# Altium schematic sheet ST_LINK_V2.SchDoc
size A4; SheetNumber: 2; SheetTotal: 5
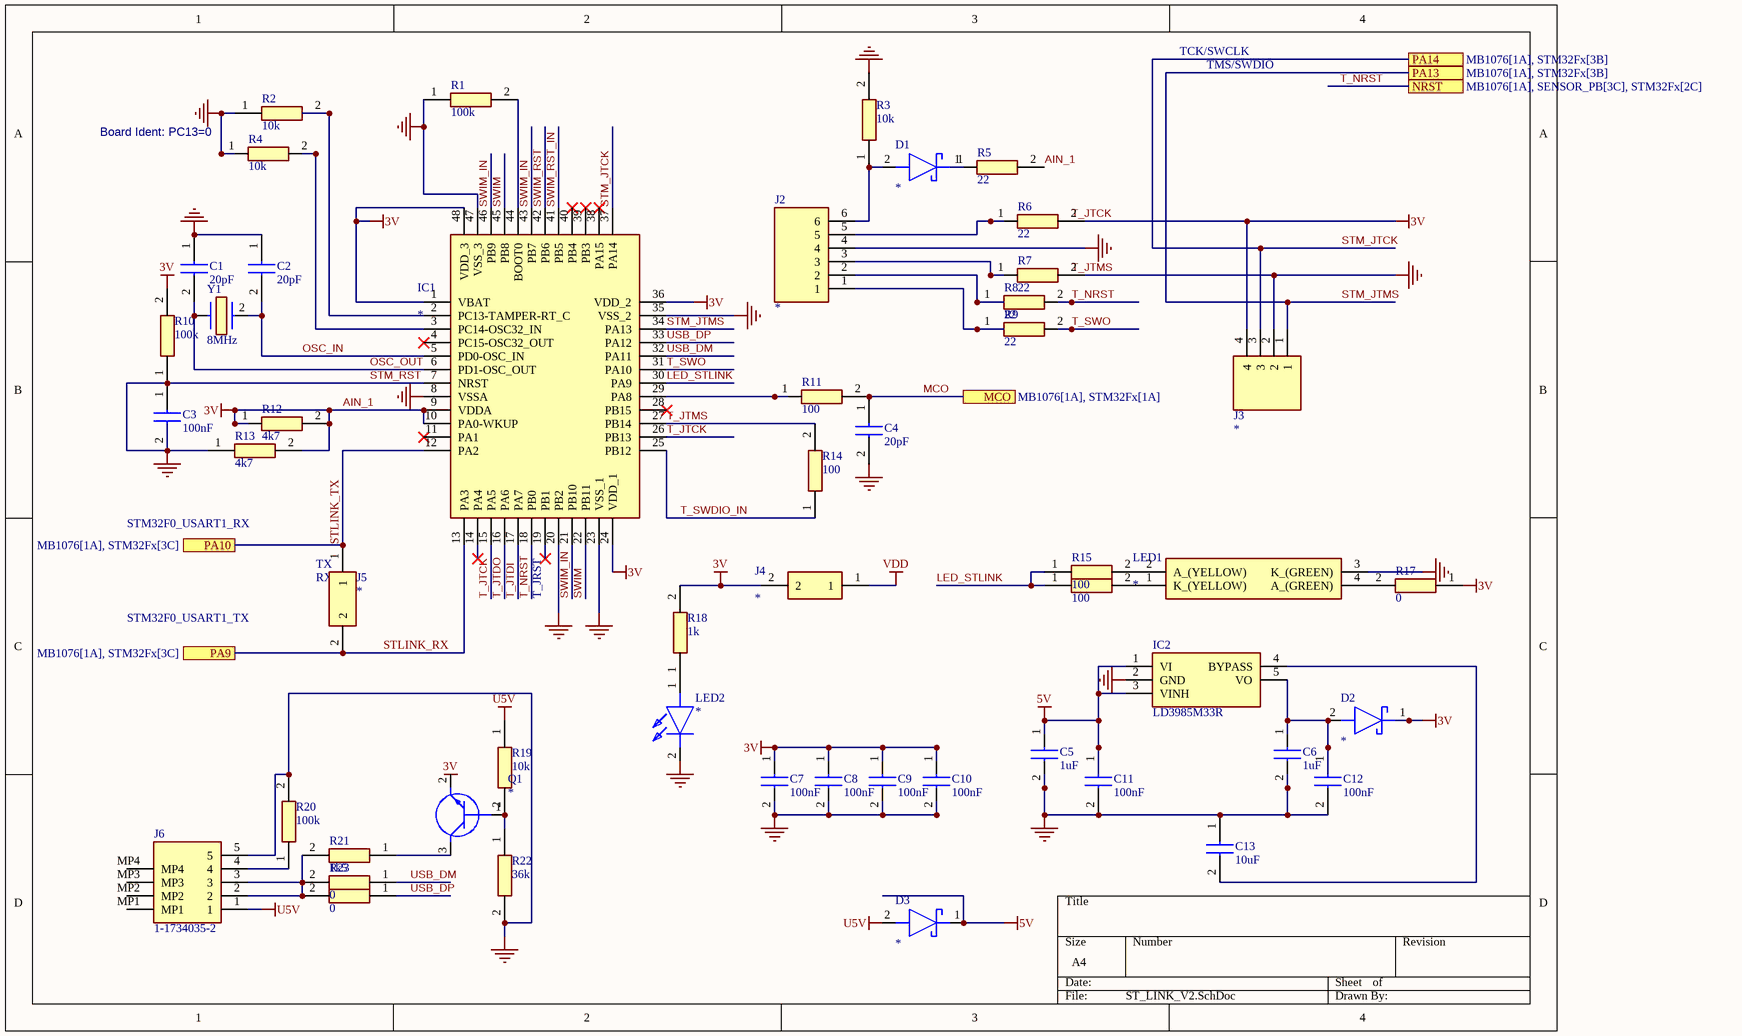
[diagram p0: ST_LINK_V2.SchDoc]

## Parts
C1  20pF  [ECHU_J1_J2_17_21]
C2  20pF  [ECHU_J1_J2_17_21]
C3  100nF  [ECHU_J1_J2_17_21]
C4  20pF  [ECHU_J1_J2_17_21]
C5  1uF  [ECHU_J1_J2_17_21]
C6  1uF  [ECHU_J1_J2_17_21]
C7  100nF  [ECHU_J1_J2_17_21]
C8  100nF  [ECHU_J1_J2_17_21]
C9  100nF  [ECHU_J1_J2_17_21]
C10  100nF  [ECHU_J1_J2_17_21]
C11  100nF  [ECHU_J1_J2_17_21]
C12  100nF  [ECHU_J1_J2_17_21]
C13  10uF  [ECHU_J1_J2_17_21]
D1  *  [SOD2513X117N]
D2  *  [SOD2513X117N]
D3  *  [SOD2513X117N]
IC1  *  [QFP50P900X900X160-48N]
IC2  LD3985M33R  [SOT95P280X145-5N]
J2  *  [HDRV6W64P0X254_1X6_1524X248X838P]
J3  *  [SHDR4W66P0X254_1X4_1016X635X1079P]
J4  *  [36471662]
J5  *  [36471662]
J6  1-1734035-2  [117340352]
LED1  *  [AVAGO_PLCC4]
LED2  *  [19213R6CAP1Q2B3T]
Q1  *  [SOT95P250X135-3N]
R1  100k  [RESC2012X60N]
R2  10k  [RESC2012X60N]
R3  10k  [RESC2012X60N]
R4  10k  [RESC2012X60N]
R5  22  [RESC2012X60N]
R6  22  [RESC2012X60N]
R7  22  [RESC2012X60N]
R8  22  [RESC2012X60N]
R9  22  [RESC2012X60N]
R10  100k  [RESC2012X60N]
R11  100  [RESC2012X60N]
R12  4k7  [RESC2012X60N]
R13  4k7  [RESC2012X60N]
R14  100  [RESC2012X60N]
R15  100  [RESC2012X60N]
R16  100  [RESC2012X60N]
R17  0  [RESC2012X60N]
R18  1k  [RESC2012X60N]
R19  10k  [RESC2012X60N]
R20  100k  [RESC2012X60N]
R21  1k5  [RESC2012X60N]
R22  36k  [RESC2012X60N]
R23  0  [RESC2012X60N]
R24  0  [RESC2012X60N]
Y1  8MHz  [FOXSDLF08020]

## Ports
MCO (see MB1076[1A], STM32Fx[1A]), NRST (see MB1076[1A], SENSOR_PB[3C], STM32Fx[2C]), PA9 (see MB1076[1A], STM32Fx[3C]), PA10 (see MB1076[1A], STM32Fx[3C]), PA13 (see MB1076[1A], STM32Fx[3B]), PA14 (see MB1076[1A], STM32Fx[3B])

## Nets
5V: C5.1 C11.1 D3.1(K) IC2.1(VI) IC2.3(VINH)
AIN_1: C7.1 C8.1 C9.1 C10.1 D2.1(K) IC1.1(VBAT) IC1.9(VDDA) IC1.10(PA0-WKUP) IC1.24(VDD_1) IC1.36(VDD_2) IC1.48(VDD_3) J3.4 J4.2 R5.2 R6.2 R10.2 R12.1 R12.2 R13.2 R17.1 R18.2  [also labelled 3V]
STM_RST: C1.1 C2.1 C3.1 C3.2 C4.2 C5.2 C6.2 C7.2 C8.2 C9.2 C10.2 C11.2 C12.2 C13.1 IC1.7(NRST) IC1.8(VSSA) IC1.20(PB2) IC1.23(VSS_1) IC1.35(VSS_2) IC1.47(VSS_3) IC2.2(GND) J2.4 J3.2 J6.5 LED1.3(K_(GREEN)) LED2.2(K) R1.1 R2.1 R3.2 R4.1 R7.2 R10.1 R13.1 R20.2 R22.2  [also labelled GND]
U5V: D3.2(A) J6.1 R19.1
VDD: J4.1
LED_STLINK: IC1.30(PA9) R15.1 R16.1
MCO: C4.1 R11.2 ; port MCO
OSC_IN: C2.2 IC1.5(PD0-OSC_IN) Y1.2(CRYSTAL_2)
OSC_OUT: C1.2 IC1.6(PD1-OSC_OUT) Y1.?1
STLINK_RX: IC1.13(PA3) J5.2 ; port PA9
STLINK_TX: IC1.12(PA2) J5.1 ; port PA10
STM_JTCK: IC1.37(PA14) J3.3 ; port PA14
STM_JTMS: IC1.34(PA13) J3.1 ; port PA13
SWIM: IC1.22(PB11) IC1.45(PB8)
SWIM_IN: IC1.21(PB10) IC1.43(PB7) IC1.46(PB9)
SWIM_RST: IC1.42(PB6)
SWIM_RST_IN: IC1.41(PB5)
T_JTCK: IC1.15(PA5) IC1.26(PB13)
T_JTDI: IC1.17(PA7)
T_JTDO: IC1.16(PA6)
T_JTMS: IC1.27(PB14) R14.2
T_NRST: IC1.18(PB0) R8.2 ; port NRST
T_SWDIO_IN: IC1.25(PB12) R14.1
T_SWO: IC1.31(PA10) R9.2
USB_DM: IC1.32(PA11) R23.1
USB_DP: IC1.33(PA12) R24.1
NetC6_1: C6.1 C12.1 D2.2(A) IC2.5(VO)
NetC13_2: C13.2 IC2.4(BYPASS)
NetD1_1: D1.1(K) R5.1
NetD1_2: D1.2(A) J2.6 R3.1
NetIC1_2: IC1.2(PC13-TAMPER-RT_C) R2.2
NetIC1_3: IC1.3(PC14-OSC32_IN) R4.2
NetIC1_29: IC1.29(PA8) R11.1
NetIC1_44: IC1.44(BOOT0) R1.2
NetJ2_1: J2.1 R9.1
NetJ2_2: J2.2 R8.1
NetJ2_3: J2.3 R7.1
NetJ2_5: J2.5 R6.1
NetJ6_2: J6.2 J6.3 R21.2 R23.2 R24.2
NetJ6_4: J6.4 R20.1
NetLED1_1: LED1.1(K_(YELLOW)) R16.2
NetLED1_2: LED1.2(A_(YELLOW)) R15.2
NetLED1_4: LED1.4(A_(GREEN)) R17.2
NetLED2_1: LED2.1(A) R18.1
NetQ1_1: Q1.1(B) R19.2 R22.1
NetQ1_3: Q1.3(C) R21.1

Not connected (* = marked no-connect by the designer): IC1 4(PC15-OSC32_OUT)* 11(PA1)* 14(PA4)* 19(PB1)* 28(PB15)* 38(PA15)* 39(PB3)* 40(PB4)*; J6 MP1 MP2 MP3 MP4; Q1 2(E)

## Notes on the sheet
- TCK/SWCLK
- TMS/SWDIO
- Board Ident: PC13=0
- STM32F0_USART1_RX
- (near J5) TX
- (near J5) RX
- STM32F0_USART1_TX
- (near IC1) T_JRST
- Labels drawn without touching a wire or pin: 3V, T_JTCK, T_JTMS

## Library data of the parts
C1-C13 = ECH-U1H102GX5: Capacitor; Manufacturer_Name: Panasonic; Datasheet Link: http://industrial.panasonic.com/cdbs/www-data/pdf/RDI0000/ABD0000C173.pdf; Manufacturer_Part_Number: ECH-U1H102GX5; Mouser Part Number: 667-ECH-U1H102GX5; Mouser Price/Stock: https://www.mouser.co.uk/ProductDetail/Panasonic/ECH-U1H102GX5?qs=DWeLBnRir%2FIlo4Nc0F6AmQ%3D%3D; Arrow Part Number: ECH-U1H102GX5; Arrow Price/Stock: https://www.arrow.com/en/products/echu1h102gx5/panasonic?region=europe
D1-D3 = BAT60JFILM: Schottky Diode; Manufacturer_Name: STMicroelectronics; Datasheet Link: https://www.mouser.jp/datasheet/2/389/cd00001944-1795661.pdf; Height: 1.17mm; Manufacturer_Part_Number: BAT60JFILM; Mouser Part Number: 511-BAT60JFILM; Mouser Price/Stock: https://www.mouser.co.uk/ProductDetail/STMicroelectronics/BAT60JFILM?qs=GnFZssByvVVVnMaukcyLZg%3D%3D; Arrow Part Number: BAT60JFILM; Arrow Price/Stock: https://www.arrow.com/en/products/bat60jfilm/stmicroelectronics?region=nac
IC1 = stm32f103c8t6: Integrated Circuit; Manufacturer_Name: STMicroelectronics; Datasheet Link: http://media.digikey.com/pdf/Data%20Sheets/ST%20Microelectronics%20PDFS/STM32F103x8,B.pdf; Height: 1.6mm; Manufacturer_Part_Number: stm32f103c8t6; Mouser Part Number: 511-STM32F103C8T6; Mouser Price/Stock: https://www.mouser.co.uk/ProductDetail/STMicroelectronics/STM32F103C8T6?qs=bhCVus9SdFtq6kqxsU5%2FDA%3D%3D; Arrow Part Number: STM32F103C8T6; Arrow Price/Stock: https://www.arrow.com/en/products/stm32f103c8t6/stmicroelectronics?utm_currency=USD&region=nac
IC2 = LD3985M33R: Integrated Circuit; Manufacturer_Name: STMicroelectronics; Datasheet Link: http://www.st.com/st-web-ui/static/active/en/resource/technical/document/datasheet/CD00003395.pdf; Height: 1.45mm; Manufacturer_Part_Number: LD3985M33R; Mouser Part Number: 511-LD3985M33R; Mouser Price/Stock: https://www.mouser.co.uk/ProductDetail/STMicroelectronics/LD3985M33R?qs=22WmWNTp1rrPOccVv4HZ7A%3D%3D; Arrow Part Number: LD3985M33R; Arrow Price/Stock: https://www.arrow.com/en/products/ld3985m33r/stmicroelectronics?region=europe
J2 = HTSW-106-07-FM-S: Connector; Manufacturer_Name: SAMTEC; Datasheet Link: https://componentsearchengine.com/Datasheets/1/HTSW-106-07-FM-S.pdf; Height: 8.38mm; Manufacturer_Part_Number: HTSW-106-07-FM-S; Mouser Part Number: 200-HTSW10607FMS; Mouser Price/Stock: https://www.mouser.co.uk/ProductDetail/Samtec/HTSW-106-07-FM-S?qs=Cqqh%252BS766wlnt4X%2FtppSRg%3D%3D; Arrow Part Number: HTSW-106-07-FM-S; Arrow Price/Stock: https://www.arrow.com/en/products/htsw-106-07-fm-s/samtec?region=nac
J3 = 3-647050-4: Connector; Manufacturer_Name: TE Connectivity; Datasheet Link: https://www.te.com/commerce/DocumentDelivery/DDEController?Action=showdoc&DocId=Customer+Drawing%7F647050%7FU%7Fpdf%7FEnglish%7FENG_CD_647050_U.pdf%7F3-647050-4; Height: 10.79mm; Manufacturer_Part_Number: 3-647050-4; Mouser Part Number: 571-3-647050-4; Mouser Price/Stock: https://www.mouser.co.uk/ProductDetail/TE-Connectivity-AMP/3-647050-4?qs=W5ux9j661SoBsMK9vpa9%252BQ%3D%3D; Arrow Part Number: 3-647050-4; Arrow Price/Stock: https://www.arrow.com/en/products/3-647050-4/te-connectivity?region=nac
J4 J5 = 3-647166-2: Connector; Manufacturer_Name: TE Connectivity; Datasheet Link: https://www.te.com/commerce/DocumentDelivery/DDEController?Action=showdoc&DocId=Customer+Drawing%7F647166%7FR1%7Fpdf%7FEnglish%7FENG_CD_647166_R1.pdf%7F3-647166-2; Height: 10.66mm; Manufacturer_Part_Number: 3-647166-2; Mouser Part Number: 571-3-647166-2; Mouser Price/Stock: https://www.mouser.co.uk/ProductDetail/TE-Connectivity/3-647166-2?qs=xsTFCgGnzbJU1qz6Np9kzA%3D%3D; Arrow Part Number: 3-647166-2; Arrow Price/Stock: https://www.arrow.com/en/products/3-647166-2/te-connectivity?region=nac
J6 = 1-1734035-2: Connector; Manufacturer_Name: TE Connectivity; Datasheet Link: https://www.arrow.com/en/products/1-1734035-2/te-connectivity; Height: 4.08mm; Manufacturer_Part_Number: 1-1734035-2; Mouser Part Number: 571-1-1734035-2; Mouser Price/Stock: https://www.mouser.co.uk/ProductDetail/TE-Connectivity/1-1734035-2?qs=vnwGVgFuQiZQrcvyrtufjA%3D%3D; Arrow Part Number: 1-1734035-2; Arrow Price/Stock: https://www.arrow.com/en/products/1-1734035-2/te-connectivity?region=nac
LED1 = HSMF-A201-A00J1: LED; Manufacturer_Name: Avago Technologies; Datasheet Link: https://docs.broadcom.com/docs/AV02-0501EN; Manufacturer_Part_Number: HSMF-A201-A00J1; Mouser Part Number: 630-HSMF-A201-A00J1; Mouser Price/Stock: https://www.mouser.co.uk/ProductDetail/Broadcom-Avago/HSMF-A201-A00J1?qs=YDL0qNrpDT7xUGI%252B3u9HMA%3D%3D
LED2 = 19-213-R6C-AP1Q2B-3T: LED; Manufacturer_Name: Everlight; Datasheet Link: https://www.arrow.com/en/products/19-213-r6c-ap1q2b-3t/everlight-electronics; Height: 0.7mm; Manufacturer_Part_Number: 19-213-R6C-AP1Q2B-3T; Arrow Part Number: 19-213-R6C-AP1Q2B-3T; Arrow Price/Stock: https://www.arrow.com/en/products/19-213-r6c-ap1q2b-3t/everlight-electronics?region=nac
Q1 = 15GN03CA-TB-E: Transistor BJT NPN; Manufacturer_Name: onsemi; Datasheet Link: https://www.mouser.com/datasheet/2/308/ENA1106-D-117745.pdf; Height: 1.35mm; Manufacturer_Part_Number: 15GN03CA-TB-E; Mouser Part Number: 863-15GN03CA-TB-E; Mouser Price/Stock: https://www.mouser.co.uk/ProductDetail/ON-Semiconductor/15GN03CA-TB-E?qs=5C9Q4QJFsuPrDQA2X5K6OA%3D%3D
R1-R24 = RK73H2ATTD5111F: Resistor; Manufacturer_Name: KOA Speer; Datasheet Link: http://www.koaspeer.com/catimages/Products/RK73H/RK73H.pdf; Height: 0.6mm; Manufacturer_Part_Number: RK73H2ATTD5111F
Y1 = FOXSDLF_080-20_1: Crystal or Oscillator; Manufacturer_Name: Fox; Manufacturer_Part_Number: FOXSDLF/080-20; Datasheet Link: http://uk.rs-online.com/web/p/products/5476452; Height: 4.5mm; Mouser Part Number: 559-FOXSD080-20-LF; Mouser Price/Stock: https://www.mouser.co.uk/ProductDetail/Fox-Abracon/FOXSDLF-080-20?qs=mzRxyRlhVdu42DWWSpKTJw%3D%3D; Arrow Part Number: FOXSDLF/080-20; Arrow Price/Stock: https://www.arrow.com/en/products/foxsdlf080-20/fox-electronics